# EAGLE board plugwatch (EAGLE 9.5.0)
REV: C
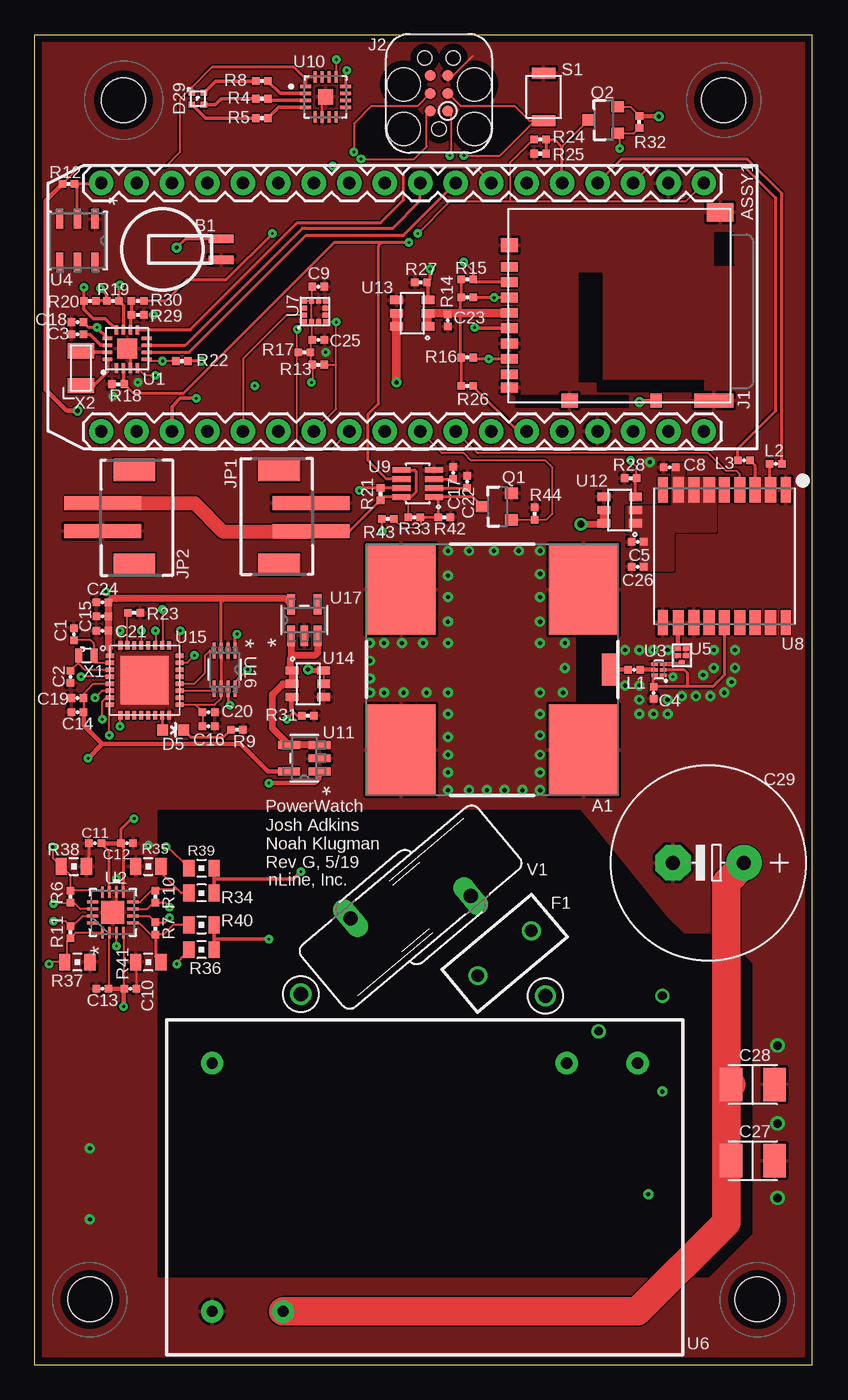
[diagram p6: board, top side]
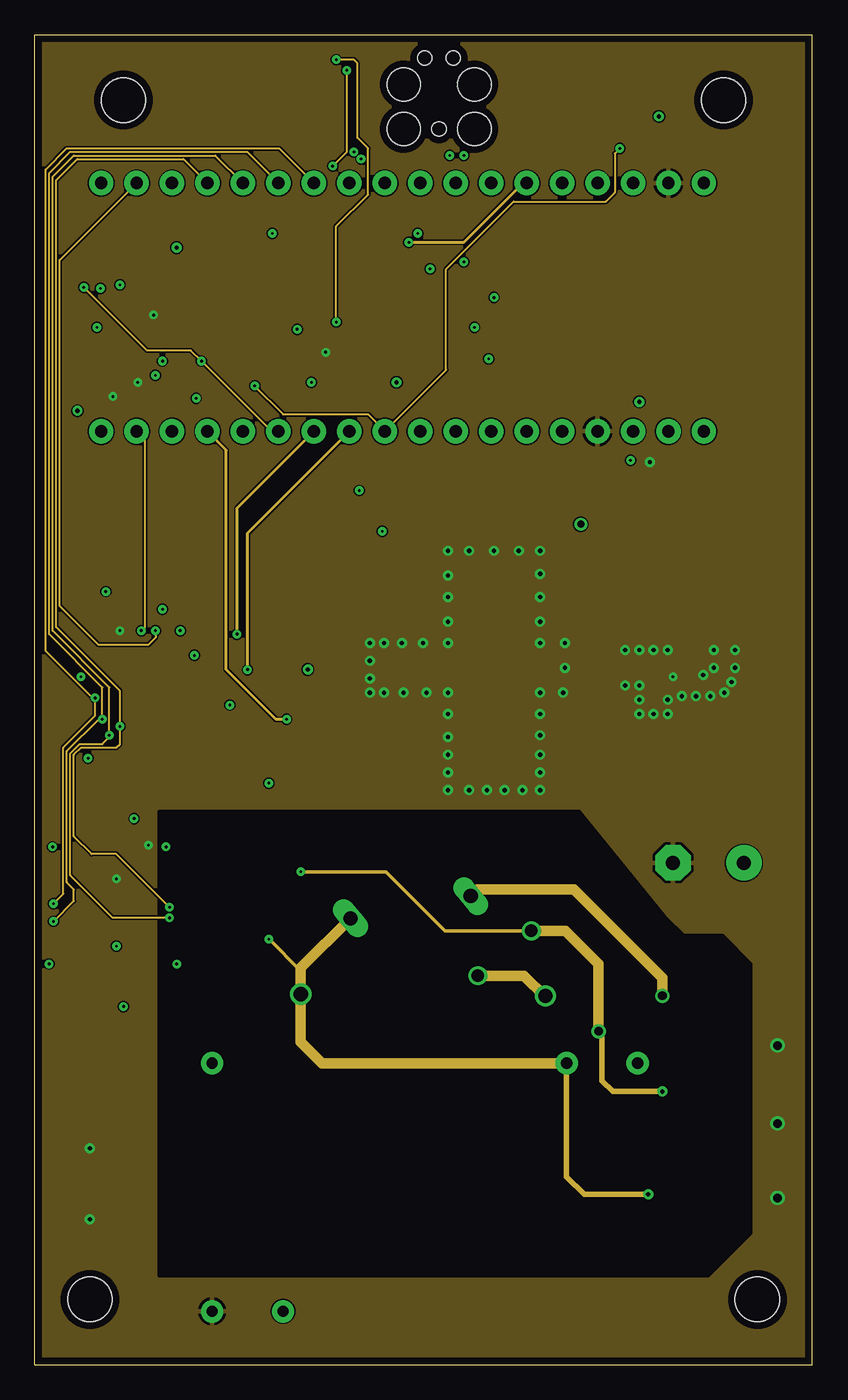
[diagram p7: board, inner layer Route2]
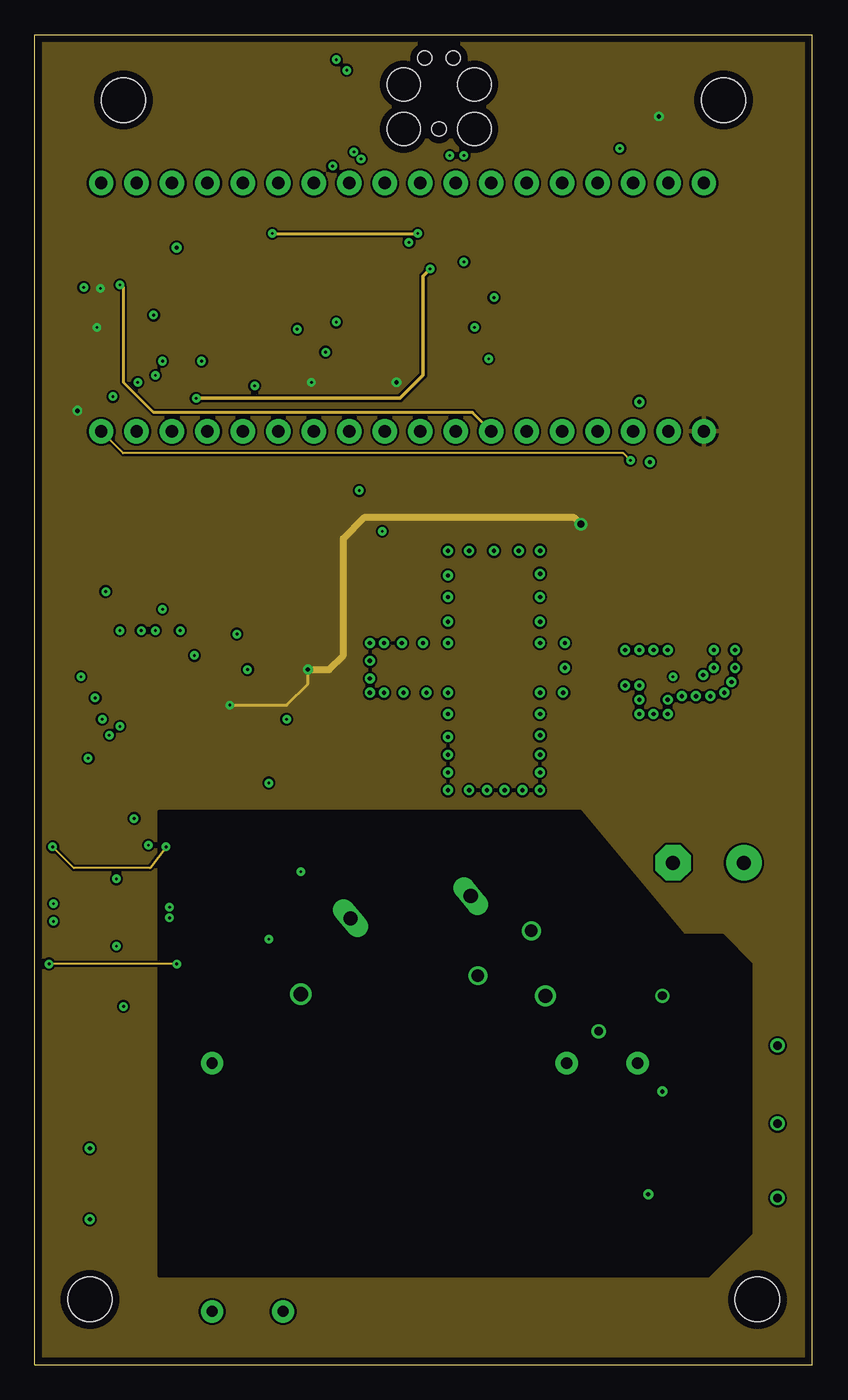
[diagram p8: board, inner layer Route15]
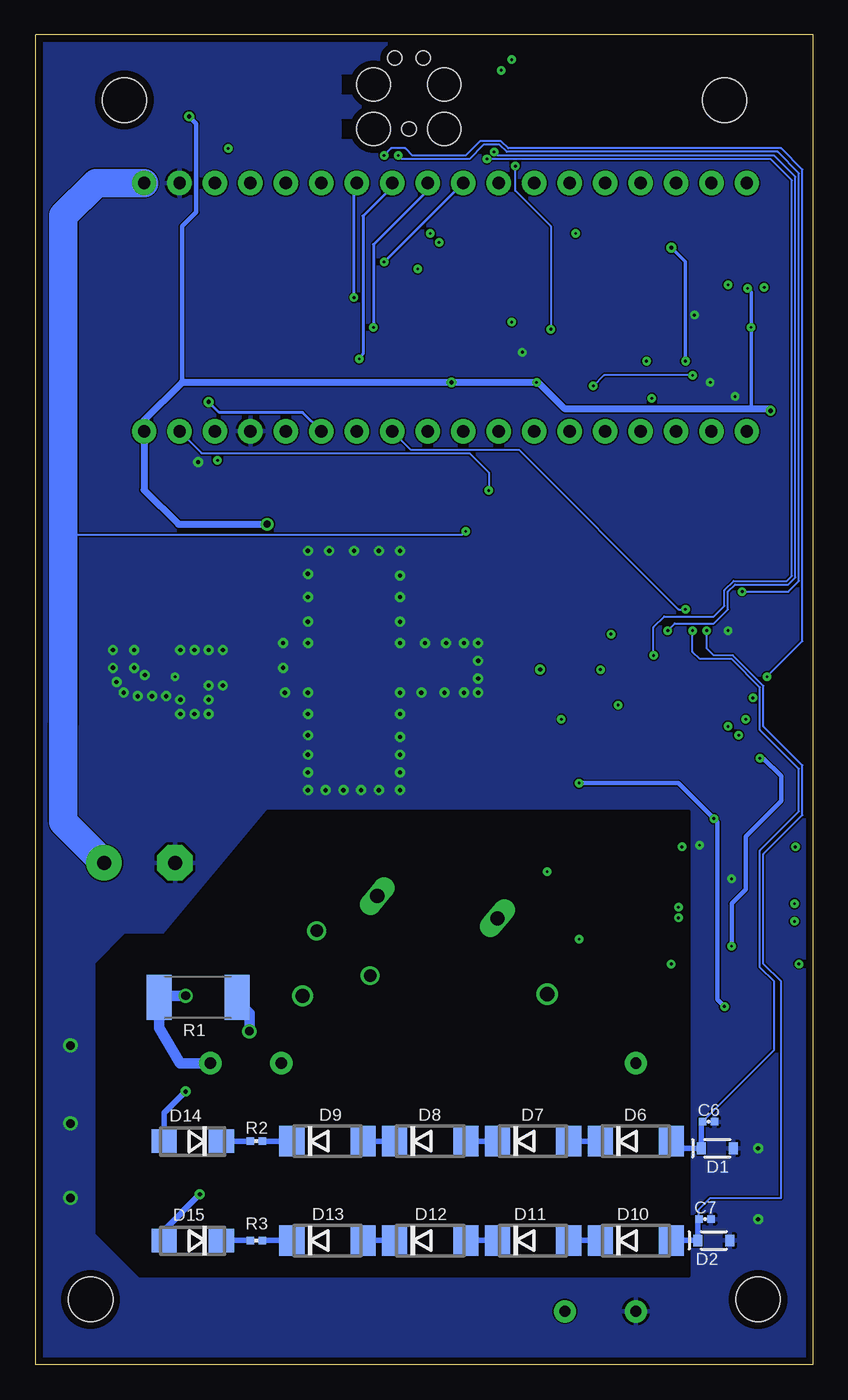
[diagram p9: board, bottom side, seen from below]

Size 55.7 x 95.25 mm. Coordinates in mm from the lower left corner, seen from the top.
Outline: 0,0 0,95.25 55.7,95.25 55.7,0 0,0
Copper layers (1+2*15+16): Top 0.0178mm / dielectric 12mil / Route2 0.0356mm / dielectric 28mil / Route15 0.0356mm / dielectric 12mil / Bottom 0.0178mm
Design rules "sunstone-4lyr_v1.0.0.3 *": minimum track width 4mil, minimum drill 8mil, track to track 4mil, track to pad 4mil, pad to pad 4mil, via to via 4mil, smd to smd 4mil, copper to edge 20mil, drill to drill 16mil, minimum pad ring 8mil, minimum via ring 8mil, stop-mask expansion 3mil, vias tented up to drill 50mil, thermal gap 8mil
Holes 3.17 mm at 3.94,4.67 6.35,90.58 51.77,4.67 49.35,90.58

## Footprints (pad centres in the part's own frame; a part is rotated, then mirrored left to right if it is on the bottom)
ANT1818B00BT1516S = smd 2.3 x 1.2: 0 0,-8.45 | smd 6.5 x 5: 1 -5.75,-6.55; 2 5.75,-6.55; 3 5.75,6.55; 4 -5.75,6.55
ELECTRON_SINGLE-ROW = drill 0.889 pad 1.753: 3V3 3.81,19.05; A0 31.75,1.27; A1 29.21,1.27; A2 26.67,1.27; A3 24.13,1.27; A4 21.59,1.27; A5 19.05,1.27; B0 46.99,1.27; B1 44.45,1.27; B2 41.91,1.27; B3 39.37,1.27; B4 36.83,1.27; B5 34.29,1.27; C0 46.99,19.05; C1 44.45,19.05; C2 41.91,19.05; C3 39.37,19.05; C4 36.83,19.05; C5 34.29,19.05; D0 31.75,19.05; D1 29.21,19.05; D2 26.67,19.05; D3 24.13,19.05; D4 21.59,19.05; D5 19.05,19.05; D6 16.51,19.05; D7 13.97,19.05; DAC 16.51,1.27; GND 11.43,19.05; GND@2 6.35,1.27; RST 6.35,19.05; RX 11.43,1.27; TX 8.89,1.27; VBAT 8.89,19.05; VIN 3.81,1.27; WKP 13.97,1.27
MS518SE-FL35E = smd 1.8 x 0.6: + 4.2,0.75; - 4.2,-0.75
0402_CAP = smd 0.536 x 0.546: 1 -0.433,0; 2 0.433,0
1210_CAP = smd 2.4 x 1.6: 1 0,1.55; 2 0,-1.55
E5-13 = drill 1.016 pad 2.54: + -2.54,0 | drill 1.016 pad 2.54 octagon: - 2.54,0
SOD-323 = smd 0.63 x 0.83: A 1.15,0; C -1.15,0
LED-0603 = smd 0.8 x 0.8: A 0,-0.75; C 0,0.75
DO214AA = smd 1.8 x 2.2: A 2.55,0; C -2.55,0
DO214AC = smd 1.8 x 1.7: A 2.05,0; C -2.05,0
1MM_SQ_4PAD = smd 0.457 x 0.457: 1 0.432,0.432; 2 0.432,-0.432; 3 -0.432,-0.432; 4 -0.432,0.432
MIRCRO_FUSE_5MM = drill 0.9: P$1 -2.5,0; P$2 2.5,0
DM3AT-SF-PEJM5 = smd 0.7 x 1.2: 1 3.2,-0.1; 2 2.1,-0.1; 3 1,-0.1; 4 -0.1,-0.1; 5 -1.2,-0.1; 6 -2.3,-0.1; 7 -3.4,-0.1; 8 -4.5,-0.1; B -5.45,-0.1 | smd 1 x 0.8: A -6.4,-10.6 | smd 1 x 1.2: MOUNT0 4.75,-0.1; MOUNT1 -6.4,-4.4 | smd 1 x 2.8: MOUNT2 -6.4,-14.75 | smd 1.3 x 1.9: MOUNT3 7.1,-15.2
TC2030-IDC = smd 0.787 x 0.787: 1 -1.27,-0.635; 2 -1.27,0.635; 3 0,-0.635; 4 0,0.635; 5 1.27,-0.635; 6 1.27,0.635 | hole 2.375: -2.54,2.54; 0.635,2.54; 0.635,-2.54; -2.54,-2.54 | hole 1.016: -2.54,0; 2.54,1.016; 2.54,-1.016
JST-2-SMD-VERT = smd 1 x 5.5: GND 1,-2; VCC -1,-2 | smd 1.6 x 3: P$1 -3.4,0.27; P$2 3.4,0.27
SOT23-3 = smd 0.8 x 0.9: 1 -0.95,-1; 2 0.95,-1; 3 0,1.1
R2512 = smd 1.8 x 3.2: 1 -2.8,0; 2 2.8,0
0402_RES = smd 0.536 x 0.546: 1 -0.433,0; 2 0.433,0
0805_RES = smd 0.8 x 1.2: 1 -0.9,0; 2 0.9,0
B3U-1000P = smd 0.8 x 1.7: 1 -1.7,0; 2 1.7,0
TESTPOINT_0.040IN = drill 1.016: TESTPOINT 0,0
QFN-16-3MM = smd 0.7 x 0.25: 1 -1.4,0.75; 2 -1.4,0.25; 3 -1.4,-0.25; 4 -1.4,-0.75; 9 1.35,-0.75; 10 1.35,-0.25; 11 1.35,0.25; 12 1.35,0.75 | smd 0.25 x 0.7: 5 -0.75,-1.4; 6 -0.25,-1.4; 7 0.25,-1.4; 8 0.75,-1.4; 13 0.75,1.4; 14 0.25,1.4; 15 -0.25,1.4; 16 -0.75,1.4 | smd 1.45 x 1.45: GND 0,0
CP_16_27 = smd 0.813 x 0.203: 1 -1.448,0.75; 2 -1.448,0.25; 3 -1.448,-0.25; 4 -1.448,-0.75; 9 1.448,-0.75; 10 1.448,-0.25; 11 1.448,0.25; 12 1.448,0.75 | smd 0.203 x 0.813: 5 -0.75,-1.448; 6 -0.25,-1.448; 7 0.25,-1.448; 8 0.75,-1.448; 13 0.75,1.448; 14 0.25,1.448; 15 -0.25,1.448; 16 -0.75,1.448 | smd 1.651 x 1.651: 17 0,0
LNA-TSLP-6-2-ALT = smd 0.45 x 0.25: 1 -0.3,0.4; 2 -0.3,0; 3 -0.3,-0.4; 4 0.3,-0.4; 5 0.3,0; 6 0.3,0.4
21-0382 = smd 1.346 x 0.533: 1 -1.525,1.27; 2 -1.525,0; 3 -1.525,-1.27; 4 1.525,-1.27; 5 1.525,0; 6 1.525,1.27
QCS5I = smd 0.35 x 0.425: 1 -0.5,0; 2 0,-0.287; 3 0.5,-0.287; 4 0.5,0.287; 5 0,0.287
IRM-03 = drill 0.8 pad 1.6: AC/L 15.24,8.89; AC/N 10.16,8.89; NC -15.24,8.89; V+ -10.16,-8.89; V- -15.24,-8.89
LGA-12 = smd 0.375 x 0.35: 1 -0.75,0.75; 2 -0.75,0.25; 3 -0.75,-0.25; 4 -0.75,-0.75; 7 0.75,-0.75; 8 0.75,-0.25; 9 0.75,0.25; 10 0.75,0.75 | smd 0.35 x 0.375: 5 -0.25,-0.75; 6 0.25,-0.75; 11 0.25,0.75; 12 -0.25,0.75
MAX-M8 = smd 1.8 x 0.7: 1 4.75,-4.4; 9 4.75,4.4; 10 -4.75,4.4; 18 -4.75,-4.4 | smd 1.8 x 0.8: 2 4.75,-3.3; 3 4.75,-2.2; 4 4.75,-1.1; 5 4.75,0; 6 4.75,1.1; 7 4.75,2.2; 8 4.75,3.3; 11 -4.75,3.3; 12 -4.75,2.2; 13 -4.75,1.1; 14 -4.75,0; 15 -4.75,-1.1; 16 -4.75,-2.2; 17 -4.75,-3.3
SOT-23-8 = smd 0.42 x 1.3: 1 -0.975,-1.17; 2 -0.325,-1.17; 3 0.325,-1.17; 4 0.975,-1.17; 5 0.975,1.17; 6 0.325,1.17; 7 -0.325,1.17; 8 -0.975,1.17
QFN50P300X300X80-17N = smd 0.84 x 0.27: 1 -1.435,0.75; 2 -1.435,0.25; 3 -1.435,-0.25; 4 -1.435,-0.75; 9 1.435,-0.75; 10 1.435,-0.25; 11 1.435,0.25; 12 1.435,0.75 | smd 0.27 x 0.84: 5 -0.75,-1.435; 6 -0.25,-1.435; 7 0.25,-1.435; 8 0.75,-1.435; 13 0.75,1.435; 14 0.25,1.435; 15 -0.25,1.435; 16 -0.75,1.435 | smd 1.1 x 1.1: 17 0,0
DDC5 = smd 1.575 x 0.559: 1 -1.092,0.95; 2 -1.092,0; 3 -1.092,-0.95; 4 1.092,-0.95; 5 1.092,0.95
TSOT23-6 = smd 0.6 x 0.927: 1 -0.95,-1.126; 2 0,-1.126; 3 0.95,-1.126; 4 0.95,1.126; 5 0,1.126; 6 -0.95,1.126
UQFN-32 = smd 0.6 x 0.3: 1 -2.5,1.75; 2 -2.5,1.25; 3 -2.5,0.75; 4 -2.5,0.25; 5 -2.5,-0.25; 6 -2.5,-0.75; 7 -2.5,-1.25; 8 -2.5,-1.75; 17 2.5,-1.75; 18 2.5,-1.25; 19 2.5,-0.75; 20 2.5,-0.25; 21 2.5,0.25; 22 2.5,0.75; 23 2.5,1.25; 24 2.5,1.75 | smd 0.3 x 0.6: 9 -1.75,-2.5; 10 -1.25,-2.5; 11 -0.75,-2.5; 12 -0.25,-2.5; 13 0.25,-2.5; 14 0.75,-2.5; 15 1.25,-2.5; 16 1.75,-2.5; 25 1.75,2.5; 26 1.25,2.5; 27 0.75,2.5; 28 0.25,2.5; 29 -0.25,2.5; 30 -0.75,2.5; 31 -1.25,2.5; 32 -1.75,2.5 | smd 3.45 x 3.45: THERMAL 0,0
DCU8 = smd 1.168 x 0.203: 1 -1.372,0.75; 2 -1.372,0.25; 3 -1.372,-0.25; 4 -1.372,-0.75; 5 1.372,-0.75; 6 1.372,-0.25; 7 1.372,0.25; 8 1.372,0.75
DBV5 = smd 1.473 x 0.559: 1 -1.118,0.95; 2 -1.118,0; 3 -1.118,-0.95; 4 1.118,-0.95; 5 1.118,0.95
S14K385 = drill 1.016 long: 1 -2.159,-3.81; 2 2.159,3.81
ABS05 = smd 0.5 x 1: A -0.55,0; B 0.55,0
2-SMD = smd 1.092 x 1.905: 1 -1.245,0; 2 1.245,0

## Placement (x,y rotation side)
A1  GPS-ANTENNA  [ANT1818B00BT1516S]  32.77,49.78 90 top
ASSY1  ELECTRON  [ELECTRON_SINGLE-ROW]  51.74,85.9 180 top
B1  [MS518SE-FL35E]  9.14,79.88 0 top
C1  4.3pF  [0402_CAP]  2.79,52.32 270 top
C2  4.3pF  [0402_CAP]  2.54,49.28 90 top
C3  47pF  [0402_CAP]  3.05,73.79 180 top
C4  10nF  [0402_CAP]  44.32,48.13 90 top
C5  10nF  [0402_CAP]  43.18,58.93 0 top
C6  10nF  [0402_CAP]  7.49,17.4 0 bottom
C7  10nF  [0402_CAP]  7.75,10.41 0 bottom
C8  0.1uF  [0402_CAP]  45.47,64.26 0 top
C9  0.1uF  [0402_CAP]  20.32,77.22 0 top
C10  0.1uF  [0402_CAP]  6.86,26.92 0 top
C11  0.1uF  [0402_CAP]  4.32,37.34 180 top
C12  0.1uF  [0402_CAP]  6.6,37.34 0 top
C13  0.1uF  [0402_CAP]  4.83,26.92 180 top
C14  0.1uF  [0402_CAP]  3.05,46.74 180 top
C15  0.1uF  [0402_CAP]  4.83,53.59 180 top
C16  0.1uF  [0402_CAP]  12.45,45.72 0 top
C17  0.82uF  [0402_CAP]  29.97,63.88 90 top
C18  1uF  [0402_CAP]  3.05,74.68 180 top
C19  1uF  [0402_CAP]  3.05,47.75 180 top
C20  1uF  [0402_CAP]  12.45,46.74 0 top
C21  1uF  [0402_CAP]  4.83,52.58 180 top
C22  2.2uF  [0402_CAP]  30.99,63.25 90 top
C23  4.7uF  [0402_CAP]  29.59,74.8 270 top
C24  4.7uF  [0402_CAP]  4.83,54.61 180 top
C25  10uF  [0402_CAP]  20.32,73.41 0 top
C26  10uF  [0402_CAP]  43.18,57.15 0 top
C27  100uF  [1210_CAP]  51.44,14.61 90 top
C28  100uF  [1210_CAP]  51.44,20.07 90 top
C29  2000uF  [E5-13]  48.26,35.94 180 top
D1  3V  [SOD-323]  6.86,15.49 0 bottom
D2  3V  [SOD-323]  7.11,8.89 0 bottom
D5  LED0603  [LED-0603]  9.91,45.47 270 top
D6  200V  [DO214AA]  12.7,16 0 bottom
D7  200V  [DO214AA]  20.07,16 0 bottom
D8  200V  [DO214AA]  27.43,16 0 bottom
D9  200V  [DO214AA]  34.8,16 0 bottom
D10  200V  [DO214AA]  12.7,8.89 0 bottom
D11  200V  [DO214AA]  20.07,8.89 0 bottom
D12  200V  [DO214AA]  27.43,8.89 0 bottom
D13  200V  [DO214AA]  34.8,8.89 0 bottom
D14  1000Vr  [DO214AC]  44.45,16 180 bottom
D15  1000Vr  [DO214AC]  44.45,8.89 180 bottom
D29  [1MM_SQ_4PAD]  11.68,90.68 90 top
F1  300VAC - 500ma  [MIRCRO_FUSE_5MM]  33.66,29.46 40 top
J1  DM3AT-SF-PEJM5  [DM3AT-SF-PEJM5]  33.91,75.44 90 top
J2  TC2030-JLINK-L  [TC2030-IDC]  28.96,91.06 90 top
JP1  [JST-2-SMD-VERT]  17.78,60.71 90 top
JP2  [JST-2-SMD-VERT]  6.86,60.71 270 top
L1  5.6n  [0402_CAP]  42.93,49.78 180 top
L2  1k  [0402_CAP]  53.09,64.52 0 top
L3  1k  [0402_CAP]  50.8,64.77 180 top
Q1  MOSFET-NCHANNELSMD  [SOT23-3]  33.15,61.47 90 top
Q2  NX3008PBK  [SOT23-3]  40.77,89.15 90 top
R1  1  [R2512]  44.06,26.3 180 bottom
R2  10  [0402_RES]  39.88,16 180 bottom
R3  10  [0402_RES]  39.88,8.89 180 bottom
R4  475  [0402_RES]  16.26,90.68 0 top
R5  750  [0402_RES]  16.26,89.28 0 top
R6  1.00k  [0402_RES]  2.54,33.53 270 top
R7  1.00k  [0402_RES]  8.64,31.24 90 top
R8  1.69k  [0402_RES]  16.26,91.95 0 top
R9  1.69k  [0402_RES]  14.48,45.47 180 top
R10  3.74k  [0402_RES]  8.64,33.53 270 top
R11  3.74k  [0402_RES]  2.54,30.99 270 top
R12  5.1k  [0402_RES]  2.41,84.58 0 top
R13  10k  [0402_RES]  20.32,71.63 180 top
R14  10k  [0402_RES]  30.99,76.45 180 top
R15  10k  [0402_RES]  30.99,77.72 180 top
R16  10k  [0402_RES]  30.99,72.14 180 top
R17  10k  [0402_RES]  19.3,72.52 0 top
R18  10k  [0402_RES]  5.97,70.23 180 top
R19  10k  [0402_RES]  5.59,76.2 0 top
R20  10k  [0402_RES]  3.94,76.2 180 top
R21  10k  [0402_RES]  24.77,62.36 90 top
R22  10k  [0402_RES]  10.54,71.88 0 top
R23  10k  [0402_RES]  7.11,53.85 180 top
R24  34k  [0402_RES]  36.2,87.76 0 top
R25  66.5k  [0402_RES]  36.2,86.74 180 top
R26  100k  [0402_RES]  30.99,70.1 180 top
R27  100k  [0402_RES]  27.66,77.52 0 top
R28  100k  [0402_RES]  42.67,63.5 0 top
R29  100k  [0402_RES]  7.37,76.2 180 top
R30  100k  [0402_RES]  7.37,75.18 0 top
R31  100k  [0402_RES]  19.56,46.48 180 top
R32  100k  [0402_RES]  43.31,89.03 270 top
R33  825k  [0402_RES]  27.18,60.71 0 top
R34  953k  [0805_RES]  11.94,33.78 180 top
R35  953k  [0805_RES]  8.13,35.69 0 top
R36  953k  [0805_RES]  11.94,29.72 180 top
R37  953k  [0805_RES]  3.05,28.83 180 top
R38  953k  [0805_RES]  2.79,35.69 0 top
R39  953k  [0805_RES]  11.94,35.56 0 top
R40  953k  [0805_RES]  11.94,31.5 0 top
R41  953k  [0805_RES]  8.13,28.83 180 top
R42  1M  [0402_RES]  29.34,60.71 0 top
R43  1M  [0402_RES]  25.27,60.58 0 top
R44  1M  [0402_RES]  35.81,60.96 90 top
S1  B3U-1000P  [B3U-1000P]  36.45,90.81 270 top
TP1  TEST_POINT_0.040IN  [TESTPOINT_0.040IN]  36.58,26.42 0 top
TP2  TEST_POINT_0.040IN  [TESTPOINT_0.040IN]  19.05,26.54 0 top
U1  AB1815-T3  [QFN-16-3MM]  6.6,72.77 90 top
U2  ADA4096-4ACPZ-R7  [CP_16_27]  5.59,32.38 90 top
U3  BGA725L6-ALT  [LNA-TSLP-6-2-ALT]  44.7,49.78 180 top
U4  DS2401P+  [21-0382]  3.05,80.52 270 top
U5  SAFFB1G56KB0F0A  [QCS5I]  46.35,50.8 90 top
U6  IRM-03-5V  [IRM-03]  27.94,12.7 0 top
U7  LIS2DH12  [LGA-12]  20.07,75.44 90 top
U8  MAX-M8  [MAX-M8]  49.4,57.91 90 top
U9  MAX67XXMAX6749MAX67XX  [SOT-23-8]  27.43,63.12 90 top
U10  MAX7315ATET  [QFN50P300X300X80-17N]  20.83,90.81 0 top
U11  REF2030AIDDCR  [DDC5]  19.3,43.43 180 top
U12  SIP32510  [TSOT23-6]  41.91,61.21 90 top
U13  SIP32510  [TSOT23-6]  27.05,75.31 90 top
U14  SIP32510  [TSOT23-6]  19.56,48.77 270 top
U15  STM32L432KC  [UQFN-32]  7.87,49.02 0 top
U16  TCA9406DCUR  [DCU8]  13.59,49.78 270 top
U17  TPS79330DBVR  [DBV5]  19.3,53.34 90 top
V1  S14K385  [S14K385]  26.92,32.77 130 top
X1  ABS05-32.768KHZ-T  [ABS05]  3.68,50.8 0 top
X2  ABS07-32.768KHZ-7-T  [2-SMD]  3.3,71.37 90 top

## Tracks (layer width: path | path; a pad name or v marks a point on that pad's centre or on a via)
5V  (via drill 0.2)
  Top 0.152: R43.1 24.84,59.74 v24.89,59.69 | ASSY1.VIN 46.61,83.31 34.04,83.31 | v27.43,81.03 29.72,83.31 34.04,83.31 | R24.1 35.69,87.76 34.04,86.11 34.04,83.31 | C27.1 49.53,14.25 49.53,14.22
  Top 0.203: R29.1 9.4,76.2 10.92,77.72 13.72,77.72 v17.02,81.03
  Top 2.032: U6.V+ 43.18,3.81 49.53,10.16 49.53,14.22 49.53,20.07 | C29.+ 50.8,35.81 49.53,34.54 49.53,20.07 | C28.1 49.53,20.07
  Route15 0.203: v17.02,81.03 v27.43,81.03
  Bottom 0.152: v24.89,59.69 25.15,59.44 53.72,59.44 | 53.72,59.44
  Bottom 2.032: ASSY1.VIN 51.38,84.63 53.72,82.3 53.72,59.44 53.73,45.97 53.73,38.87 C29.+
!EXTERNAL_RST  (via drill 0.2)
  Top 0.203: U9.7 R21.2 23.42,62.79 v23.24,62.61
  Bottom 0.152: ASSY1.RST 43.81,65.28 24.64,65.28 23.24,63.88 v23.24,62.61
!RST  (via drill 0.2)
  Top 0.152: J2.3 30.48,90.17 34.37,90.17 35.43,89.11 35.81,89.11 | 35.81,89.11 S1.2 | U15.4 v3.31,49.27 v3.3,49.28 | v30.73,86.61 33.32,86.61 35.81,89.11
  Bottom 0.152: v3.3,49.28 0.76,51.82 0.76,85.6 2.29,87.12 21.84,87.12 22.35,87.63 23.88,87.63 24.89,86.61 28.7,86.61 29.21,87.12 30.23,87.12 v30.73,86.61
!RTC_CS  (via drill 0.2)
  Top 0.203: v3.5,77.17 R20.2 | v11.94,71.88 R22.2
  Top 0.254: R20.2 3.5,75.62 4.19,74.93 5.04,74.93 U1.12
  Route2 0.152: ASSY1.C5 16.97,66.85 v11.94,71.88 11.18,72.64 8.03,72.64 v3.5,77.17
!RTC_INT1  (via drill 0.2)
  Top 0.203: v6.1,77.34 6.02,77.27 R19.2
  Top 0.254: U1.11 6.35,75.87 R19.2
  Route15 0.152: ASSY1.D5 32.26,67.28 32.26,67.31
  Route15 0.203: 32.26,67.31 31.37,68.2 8.51,68.2 6.35,70.36 6.35,77.22 6.22,77.34 v6.1,77.34
!RTC_INT2  (via drill 0.2)
  Top 0.152: Q2.1 41.91,88.2 | 41.91,88.2 42.92,88.2 R32.2 | v41.91,87.12 41.91,88.2 | U1.4 7.86,70.87 v8.64,70.87
  Route2 0.152: ASSY1.D2 25.08,66.86 | 25.08,66.86 29.46,71.25 29.46,78.49 34.29,83.31 40.89,83.31 41.54,83.96 41.54,86.75 v41.91,87.12 | v15.75,70.1 17.78,68.07 23.88,68.07 25.08,66.86
  Bottom 0.152: v8.64,70.87 14.99,70.87 v15.75,70.1
!SD_CS  (via drill 0.2)
  Top 0.203: J1.2 31.61,77.54 R15.1 31.42,78.31 v30.73,78.99
  Bottom 0.203: ASSY1.A2 30.71,78.99 v30.73,78.99
!SD_DETECT  (via drill 0.3)
  Top 0.152: R26.1 | R26.1 31.38,70.06
  Top 0.203: ASSY1.D6 34.59,66.85 31.38,70.06 | J1.A 43.38,69.04 v43.31,68.96
  Bottom 0.203: ASSY1.D6 36.58,68.2 42.55,68.2 v43.31,68.96
AC_COPROC_VCC  (via drill 0.2)
  Top 0.152: C16.1 C20.1 11.48,47.27 U15.17 12.89,47.27 13.34,47.72 U16.6 | 5.84,54.86 5.59,54.86 v5.08,55.37 | J2.1 29.84,89.53 29.84,86.74 v29.72,86.61
  Top 0.203: 13.46,54.86 13.34,54.74 U16.3 U16.6 | C15.1 C21.1
  Top 0.305: 5.33,51.31 5.37,51.27 U15.1
  Top 0.508: U17.5 17.95,54.86 13.46,54.86 5.84,54.86 5.51,54.86 C24.1 C21.1 5.26,51.38 5.33,51.31
  Bottom 0.152: v5.08,55.37 1.78,55.37 1.02,56.13 1.02,85.34 2.54,86.87 21.95,86.87 22.46,87.38 23.62,87.38 24.64,86.36 29.46,86.36 v29.72,86.61
AC_L_800V_DETECT  (via drill 0.2)
  Top 0.152: v8.64,52.58 8.64,51.53 U15.27
  Route2 0.152: v8.64,52.58 8.64,52.07 8.13,51.56 4.57,51.56 1.78,54.36 1.78,79.12 ASSY1.B1
  Bottom 0.152: C6.1 2.79,22.53 2.79,27.43 3.81,28.45 3.81,36.83 1.02,39.62 1.02,42.67 3.81,45.47 3.81,48.51 5.84,50.55 8.13,50.55 8.64,51.05 v8.64,52.58
  Bottom 0.406: D6.A 9.63,15.49 D1.C 8.01,17.32 C6.1
AC_L_HV_OUT  (via drill 0.2)
  Top 0.152: U2.14 3.25,32.63 2.79,33.09 R6.2 2.46,33.02 v1.33,33.02 | v4.32,47.75 4.84,48.27 U15.6
  Route2 0.152: v1.33,33.02 2.03,33.72 2.03,44.2 4.32,46.48 v4.32,47.75 4.29,47.78 4.12,47.78 0.76,51.13 0.76,85.6 2.29,87.12 17.5,87.12 ASSY1.A0
AC_L_LV_OUT  (via drill 0.2)
  Top 0.152: U2.7 8.05,32.63 8.51,33.09 R10.2 9.32,33.09 v9.65,32.77 | v6.1,45.72 6.1,46.49 U15.9
  Route2 0.152: v9.65,32.77 5.84,36.58 4.06,36.58 2.79,37.85 2.79,43.69 3.3,44.2 5.84,44.2 6.1,44.45 v6.1,45.72 6.1,48.26 1.52,52.83 1.52,84.84 3.05,86.36 10.64,86.36 ASSY1.B3
AC_L_SENSE  (via drill 0.2, 0.3, 0.61)
  Top 0.254: v19.05,35.31 18.52,34.78 12.84,34.78 R34.1 R39.2
  Route2 0.254: v19.05,35.31 25.15,35.31 29.38,31.07 F1.P$2
  Route2 0.406: v40.39,23.88 40.64,23.62 40.64,20.32 41.4,19.56 v44.96,19.56
  Route2 0.762: F1.P$2 38.02,31.07 40.39,28.7 v40.39,23.88
  Bottom 0.406: v44.96,19.56 46.5,18.02 D14.A
  Bottom 0.762: v40.39,23.88 40.39,25.17 41.26,26.05 R1.1
AC_N  (via drill 0.2, 0.3)
  Top 0.254: R40.2 12.84,30.48 | 12.84,30.48 R36.1 | v16.76,30.48 12.84,30.48
  Route2 0.152: 19.05,28.19 19.05,27.94
  Route2 0.254: v16.76,30.48 19.05,28.19
  Route2 0.406: U6.AC/N 38.1,13.46 39.37,12.19 v43.94,12.19
  Route2 0.762: V1.2 19.05,28.4 19.05,27.94 TP2.TESTPOINT 19.05,23.11 20.57,21.59 U6.AC/N
  Bottom 0.406: v43.94,12.19 46.5,9.63 D15.A
AC_N_800V_DETECT  (via drill 0.2)
  Top 0.152: v7.62,52.58 v7.62,52.57 U15.29
  Route2 0.152: v7.62,52.58 7.87,52.83 7.87,66.27 ASSY1.C1
  Bottom 0.152: C7.1 8.18,11.12 7.37,11.94 2.29,11.94 2.29,27.43 3.56,28.7 3.56,36.58 0.76,39.37 0.76,42.93 3.56,45.72 3.56,48.62 5.74,50.8 7.11,50.8 7.62,51.31 v7.62,52.58
  Bottom 0.406: D10.A D2.C 8.26,10.33 C7.1
AC_N_HV_OUT  (via drill 0.2)
  Top 0.152: U2.6 8.18,32.13 R7.2 9.32,31.68 v9.65,32 | v5.33,45.09 5.33,47.23 U15.8
  Route2 0.152: v9.65,32 5.59,32 2.54,35.05 2.54,43.79 3.2,44.45 4.83,44.45 5.33,44.96 v5.33,45.09 5.33,48.51 1.27,52.58 1.27,85.09 2.79,86.61 12.93,86.61 ASSY1.B4
AC_N_LV_OUT  (via drill 0.2)
  Top 0.152: U2.15 3.43,32.13 2.72,31.42 R11.1 2.21,31.75 v1.33,31.75 | v4.83,46.23 4.83,47.5 5.1,47.77 U15.7
  Route2 0.152: v1.33,31.75 2.79,33.21 2.79,34.04 2.29,34.54 2.29,43.94 4.57,46.23 v4.83,46.23 4.83,48.51 1.02,52.32 1.02,85.34 2.54,86.87 15.21,86.87 ASSY1.B5
AC_SCL
  Top 0.152: U15.19 12.7,48.27 U16.5
AC_SDA
  Top 0.152: U15.20 11.43,48.77 12.19,49.53 12.19,50.8 12.55,51.16 U16.4
AC_SENSE_PWR_EN  (via drill 0.2)
  Top 0.203: R31.2 18.8,46.48 18.29,46.99 18.29,47.75 18.32,47.93 U14.3 18.43,46.63 v18.03,46.23
  Route2 0.203: v18.03,46.23 17.27,46.23 13.72,49.78 13.72,65.51 ASSY1.C3
AC_SENSE_VCC
  Top 0.508: U17.3 20.25,50.99 20.07,50.8 18.54,50.8 18.35,50.61 | U17.1 18.35,50.61 | 18.35,50.61 18.29,50.55 18.29,49.86 U14.1 U14.2 17.78,48.77 17.02,48.01 17.02,45.58 U11.4 U11.3
ACCEL_INT
  Top 0.152: U7.12 18.04,75.19 14.91,72.06 ASSY1.C4
ANT
  Top 0.318: A1.0 L1.2
BOOT0
  Top 0.152: U15.31 6.6,51.54 6.6,53.85 R23.2
GND  (via drill 0.2, 0.3, 0.61)
  Top 0.152: J2.5 29.97,92.33 31.37,93.73 | U10.6 20.58,90.56 U10.17 | U2.10 5.84,32.63 U2.17 | C10.2 7.29,28.43 R41.2
  Top 0.203: U1.3 6.85,72.52 U1.GND | R38.2 3.88,35.88 C11.2
  other vias: 5.59,69.34 7.37,70.36 29.59,44.96 29.59,46.61 29.59,48.13 28.07,48.13 26.42,48.13 26.29,51.69 27.81,51.69 29.59,51.69 29.59,53.21 29.59,54.99 29.59,56.52 29.59,58.29 36.2,45.09 36.2,46.61 36.2,48.13 37.85,48.13 37.97,49.91 37.97,51.69 36.2,51.69 36.2,53.21 36.2,54.99 36.2,56.64 36.2,58.29 8.51,75.18 25.02,51.69 24,51.69 24,50.42 24,49.15 24,48.13 25.02,48.13 29.59,43.69 29.59,42.42 29.59,41.15 31.11,41.15 32.38,41.15 33.66,41.15 34.92,41.15 36.2,41.15 36.2,42.42 36.2,43.69 31.11,58.29 32.89,58.29 34.67,58.29 42.29,51.18 43.31,51.18 44.32,51.18 45.34,51.18 42.29,48.64 43.31,48.64 43.31,47.62 43.31,46.61 44.32,46.61 45.34,46.61 45.34,47.62 46.35,47.88 47.37,47.88 48.39,47.88 49.4,48.13 49.91,48.9 50.16,49.91 50.16,51.18 48.64,51.18 48.64,49.91 47.88,49.4 45.72,49.28 53.21,22.86 53.21,17.27 53.21,11.94 8.13,37.21 5.84,34.8 20.83,72.52 44.07,64.64 3.94,10.41 3.94,15.49 6.1,52.58
  pour Bottom (rank 2): 55.75,0 0,0 0,95.25 55.63,95.25
  pour Route2 (rank 2): 55.75,0 0,0 0.13,95.25 55.37,95.12
  pour Top (rank 2): 55.75,0 0,0 0,95.25 55.63,95.25
GPS_PPS  (via drill 0.2)
  Top 0.152: U8.4 50.5,63.8 50.29,64.01 49.53,64.01 48.26,65.28 31.73,65.28 ASSY1.D4 | v9.14,54.1 9.14,51.54 U15.26
  Bottom 0.152: ASSY1.D4 28.83,65.53 21.08,65.53 9.65,54.1 v9.14,54.1
GPS_PWR_EN  (via drill 0.2)
  Top 0.152: R28.2 43.1,64.34 v42.67,64.77
  Top 0.203: U12.3 43.04,63.43 R28.2
  Route15 0.152: ASSY1.C0 6.33,65.28 42.16,65.28 v42.67,64.77
GPS_RF_IN
  Top 0.318: U5.4 46.07,53.13 U8.11
GPS_RXD
  Top 0.203: L3.2 50.37,65.61 53.09,68.33 53.09,83.57 50.8,85.85 44.07,85.85 ASSY1.TX
GPS_TXD
  Top 0.203: L2.2 53.52,83.89 51.05,86.36 42.04,86.36 ASSY1.RX
GPS_VCC
  pour Top (isolate 0.152, no thermals): 42.42,59.69 42.42,61.47 45.72,61.47 45.72,64.52 46.48,64.52 46.48,63.5 48.77,63.5 48.77,59.69 45.72,59.69 45.72,56.9 43.43,56.9 43.43,59.69
LNA_IN
  Top 0.318: L1.1 U3.5
LNA_OUT
  Top 0.318: U3.3 46.24,50.18 U5.1
N$1
  Top 0.203: D5.C 11.16,44.96 13.54,44.96 R9.2
N$2  (via drill 0.61)
  Route2 0.762: V1.1 31.7,34.04 38.61,34.04 44.96,27.69 v44.96,26.42
  Bottom 0.762: U6.AC/L 45.36,21.59 46.86,24.1 R1.2 45.99,26.42 v44.96,26.42
N$3  (via drill 0.2)
  Top 0.152: U2.1 2.92,30.94 R11.2 2.29,30.3 2.29,28.86 R37.2 1.14,28.83 v1.02,28.7 | v10.16,28.7 11.01,29.71 R36.2
  Route15 0.152: v10.16,28.7 v1.02,28.7
N$4
  Top 0.152: U2.8 7.54,33.13 8.37,33.96 R10.1 8.71,34.04 10.23,34.04 | R34.2 10.49,33.78 10.23,34.04 | 10.23,34.04 8.86,35.41 R35.2
N$5  (via drill 0.2, 0.3)
  Top 0.152: R22.1 v9.14,71.88 8.14,71.88 U1.5
  Top 0.203: B1.+ 10.78,80.63 v10.16,80.01
  Bottom 0.254: v10.16,80.01 9.14,78.99 v9.14,71.88
N$6  (via drill 0.2)
  Top 0.152: U2.12 4.71,33.96 R6.1 2.54,35.06 2.52,35.06 R38.1 1.27,36.31 v1.27,37.08 | R39.1 9.51,37.08 v9.4,37.08
  Route15 0.152: v9.4,37.08 8.26,35.56 2.79,35.56 v1.27,37.08
N$7
  Top 0.203: U15.15 9.12,45.5 D5.A
N$8
  Top 0.152: U2.5 7.48,31.64 8.31,30.81 R7.1 9.22,30.81 9.91,31.5 R40.1
  Top 0.203: R7.1 8.64,29.22 R41.1
N$9
  Top 0.152: U15.3 3.57,49.77 3.13,50.21 3.13,50.3 | 3.13,50.3 X1.A | C2.2 3.13,50.3
N$10
  Top 0.152: ASSY1.WKP 37.77,87.26 Q2.3
  Top 0.203: ASSY1.WKP 37.77,87.22 37.29,87.7 37.15,87.76 R24.2 R25.1
N$11
  Top 0.152: U15.2 4.34,50.27 4.23,50.38 X1.B 4.23,51.65 3.99,51.89 C1.2
N$12
  Route2 0.762: TP1.TESTPOINT 36.58,26.32 35.04,27.86 F1.P$1
N$13
  Top 0.254: U1.14 4.7,73.02 4.48,73.24 4.48,73.26 3.96,73.79 C3.1
N$14
  Bottom 0.406: D9.A D8.C
N$15
  Bottom 0.406: D8.A D7.C
N$16
  Bottom 0.406: D7.A D6.C
N$18
  Top 0.203: R26.2 R16.2 30.48,72.21 30.48,75.31 30.48,76.38 R14.2 R15.2
  Top 0.508: U13.2 U13.1
  Top 0.61: U13.2 29.72,75.31 | 29.72,75.31 30.48,75.31 33.98,75.31 J1.4 | C23.1 29.64,75.24 29.72,75.31
N$20
  Top 0.254: U1.15 3.4,72.52 X2.2
N$21
  Top 0.254: U1.16 5.2,71.12 4.22,70.13 X2.1
N$23
  Top 0.152: U9.8 26.75,61.66 R33.1
  Top 0.203: U9.5 27.22,64.09 27.3,64.01 27.3,62.48 26.96,62.14 U9.8 24.98,62.14 R21.1 22.55,59.71 JP1.VCC
  Top 1.016: JP2.VCC 11.45,61.71 13.46,59.69 19.76,59.69 JP1.VCC
N$25
  Top 0.254: U1.10 6.85,75.11 R30.1 R29.2
N$26
  Top 0.254: D29.3 12.9,90.25 13.34,90.68 R4.1
N$30
  Bottom 0.406: R2.1 D9.C
N$31
  Top 0.152: R43.2 26.34,59.94 27.43,59.94 27.69,60.2 27.69,60.71
  Top 0.203: R33.2 27.69,60.71 R42.1 28.9,61.84 U9.1 31.37,62.14 Q1.3
N$32
  Bottom 0.406: D14.C R2.2
N$35
  Bottom 0.406: D13.A D12.C
N$36
  Top 0.203: U9.3 C17.1
N$37
  Bottom 0.406: D12.A D11.C
N$38
  Bottom 0.406: D11.A D10.C
N$39
  Top 0.203: U9.2 30.97,62.79 C22.1
N$40
  Top 0.203: L2.1 52.65,62.71 U8.2
N$41
  Top 0.203: U8.3 51.6,64.4 L3.1
N$42
  Top 0.254: D29.4 12.22,89.28 R5.1
N$46
  Bottom 0.406: R3.1 D13.C
N$47
  Bottom 0.406: D15.C R3.2
N$49
  Top 0.254: D29.2 12.95,91.95 R8.1
N$50
  Top 0.254: R8.2 17.58,91.06 U10.2
N$51
  Top 0.254: R5.2 17.46,90.06 U10.4
N$52
  Top 0.254: R4.2 16.81,90.56 U10.3
NOTHING
  cutout Top (isolate 0.305): 8.89,6.35 48.26,6.35 51.31,9.4 51.31,28.7 49.28,30.73 46.48,30.73 45.21,32 39.06,39.62 8.89,39.62
  cutout Route2 (isolate 0.305): 8.89,6.35 48.26,6.35 51.31,9.4 51.31,28.7 49.28,30.73 46.48,30.73 45.21,32 39,39.62 8.89,39.62
  cutout Route15 (isolate 0.305): 8.89,6.35 48.26,6.35 51.31,9.4 51.31,28.7 49.28,30.73 46.48,30.73 39.07,39.62 8.89,39.62
  cutout Bottom (isolate 0.305): 8.89,6.35 48.26,6.35 51.31,9.4 51.31,28.7 49.28,30.73 46.48,30.73 39.07,39.62 8.89,39.62
PARTICLE_RST
  Top 0.152: Q1.1 35.8,60.52 | R44.1 36.65,60.53 37.08,60.96 37.08,64.26 36.58,64.77 31.24,64.77 30.73,65.28 29.18,65.28 ASSY1.D3
  Top 0.203: 35.8,60.52 R44.1
REF_1V5  (via drill 0.2)
  Top 0.152: U2.4 6.35,30.93 6.35,27.18 C10.1 | U2.2 5.34,30.92 5.32,30.79 5.32,27.23 C13.1
  Top 0.203: U2.9 6.34,34.58 6.35,34.59 6.35,37.34 C12.1 6.17,38.35 6.86,39.04 7.04,39.04 v7.11,39.12 | U2.11 5.33,36.76 C11.1
  Top 0.305: U11.1 20.4,41.99 20.07,41.66 v16.76,41.66 | v6.35,25.65 6.35,26.85 C10.1 C13.1 | C12.1 C11.1
  Bottom 0.305: v16.76,41.66 9.65,41.66 v7.11,39.12 6.86,38.86 6.86,26.16 v6.35,25.65
REF_3V  (via drill 0.2)
  Top 0.152: C14.1 C19.1 3.48,48.04 4.14,48.75 5.35,48.75 U15.5 | U2.3 v5.84,29.97
  Top 0.305: U11.5 16.7,42.48 14.73,44.45 4.83,44.45 | 4.83,44.45 3.48,45.8 C14.1 | v3.81,43.43 4.83,44.45
  Bottom 0.305: v5.84,29.97 5.84,33.02 4.83,34.04 4.83,37.85 2.29,40.39 2.29,42.16 3.56,43.43 v3.81,43.43
SD_ENABLE  (via drill 0.2)
  Top 0.254: U13.3 28.18,77.52 R27.2 28.32,77.75 v28.32,78.49 | ASSY1.C2 9.83,68.63 10.41,69.22 v11.56,69.22
  Route15 0.254: v11.56,69.22 26.16,69.22 27.81,70.87 27.81,77.98 v28.32,78.49
SD_MISO  (via drill 0.2)
  Top 0.203: U1.6 11.05,72.52 19.43,80.9 26.42,80.9 ASSY1.A4 | J1.7 v32.51,72.04 31.52,72.04 R16.1
  Bottom 0.203: ASSY1.A4 30.15,84.38 32.26,82.27 32.26,72.39 32.51,72.14 v32.51,72.04
SD_MOSI  (via drill 0.2)
  Top 0.203: U1.9 11.13,74.12 18.8,81.79 24.77,81.79 26.42,83.44 26.42,85.34 26.87,85.8 31.52,85.8 ASSY1.A5 | J1.3 v32.89,76.44 31.44,76.44 R14.1
  Bottom 0.203: v32.89,76.44 32.89,84.31 32.69,84.52 ASSY1.A5
SD_SCLK  (via drill 0.2)
  Top 0.203: U1.7 10.79,73.03 19.18,81.41 19.3,81.41 25.65,81.41 27.61,83.36 ASSY1.A3
  Top 0.254: J1.5 31.55,74.24 v31.5,74.3
  Bottom 0.203: ASSY1.A3 27.61,84.12 31.5,80.24 v31.5,74.3
SENSORS_SCL  (via drill 0.2)
  Top 0.152: U10.12 22.26,92.62 v22.35,92.71 | ASSY1.D1 21.21,65.53 19.3,65.53 18.8,66.04 18.8,72.52 | U7.1 v18.8,74.17 18.8,72.52 | R17.1 18.8,72.52
  Top 0.203: U16.8 14.34,48.88 v15.24,49.78
  Route2 0.152: v21.34,85.85 22.35,86.87 v22.35,92.71
  Route2 0.203: v15.24,49.78 15.24,59.56 ASSY1.D1
  Bottom 0.152: v18.8,74.17 18.8,81.53 21.34,84.07 v21.34,85.85
SENSORS_SDA  (via drill 0.2)
  Top 0.152: ASSY1.D0 21.59,68.45 21.59,71.63 | 21.59,71.63 v21.59,74.68 20.83,74.68 U7.4 | v21.59,93.47 21.59,92.25 U10.13 | R13.1 21.59,71.63
  Top 0.203: U16.1 14.34,52.19 v14.48,52.32
  Route2 0.152: v21.59,74.68 21.59,81.53 23.88,83.82 23.88,87.12 23.11,87.88 23.11,93.22 22.86,93.47 v21.59,93.47
  Route2 0.203: v14.48,52.32 14.48,61.34 ASSY1.D0
SERIAL_NUM
  Top 0.203: U4.2 3.05,84.38 R12.2 4.7,84.58 ASSY1.B0
SWDCLK  (via drill 0.2)
  Top 0.152: U15.24 10.37,52.54 v10.41,52.58 | J2.4 27.43,90.17 24.13,90.17 22.86,88.9 v22.86,86.87
  Bottom 0.152: v10.41,52.58 9.91,53.09 7.11,53.09 6.1,54.1 6.1,55.37 5.59,55.88 1.78,55.88 1.27,56.39 1.27,85.09 2.79,86.61 22.61,86.61 v22.86,86.87
SWDIO  (via drill 0.2)
  Top 0.152: U15.23 10.39,50.29 10.92,50.29 v11.43,50.8 | v23.37,86.36 27.18,86.36 28.07,87.25 28.07,89.53 J2.2
  Bottom 0.152: v11.43,50.8 11.43,52.83 10.67,53.59 7.11,53.59 6.35,54.36 6.35,55.48 5.69,56.13 1.88,56.13 1.52,56.49 1.52,84.84 3.05,86.36 v23.37,86.36
VCC  (via drill 0.2, 0.3, 0.51)
  Top 0.152: 19.82,77.14 U7.9 | U7.9 U7.10 | 19.82,73.48 U7.2 U7.9 | Q2.2 42.66,90.1 R32.1 | 19.74,73.26 R17.2 19.74,71.78 | R13.2 19.89,70.43 | 12.7,92.96 11.25,91.52 10.41,90.68 10.41,86.87 9.4,85.85 3.25,85.85 R12.1 | U10.16 U10.15 U10.14 | U14.6 U14.5
  Top 0.203: R20.1 4.45,76.2 | U13.6 U13.5 | U10.16 20.04,92.2 19.56,92.2 19.43,92.08 | 19.43,92.08 19.39,92.04 U10.1 | D29.1 11.25,91.52 | 12.7,92.96 18.54,92.96 19.43,92.08 | U16.7 13.84,47.38 v13.97,47.24 | v4.45,74.3 3.86,74.3 C18.1 | C25.1 19.74,73.26 | 19.74,71.78 R13.2 | 19.89,70.43 v19.81,70.36
  Top 0.254: U1.13 4.45,74.28 v4.45,74.3 | 4.45,76.2 R19.1 5.16,76.63 v4.7,77.09 | C9.1 19.82,77.14 | 19.82,73.48 C25.1
  Top 0.305: R12.1 0.76,83.36 0.76,69.85 2.29,68.33 v3.05,68.33 | v44.7,89.41 43.36,89.41 R32.1
  Top 0.406: U14.6 19.62,49.72 v19.56,49.78
  Top 0.508: v25.91,70.36 25.93,70.36 | v39.12,60.2 40.72,60.2
  Top 0.61: 40.72,60.2 U12.6
  Top 0.635: U12.5 U12.6 | 25.93,70.36 U13.5
  Route15 0.203: v13.97,47.24 18.03,47.24 19.56,48.77 v19.56,49.78
  Route15 0.508: v19.56,49.78 21.08,49.78 22.1,50.8 22.1,59.18 23.62,60.71 38.61,60.71 v39.12,60.2
  Bottom 0.254: v4.7,77.09 4.45,76.83 v4.45,74.3 4.45,68.45
  Bottom 0.305: 45.21,70.36 45.21,81.53 44.2,82.55 44.2,88.9 v44.7,89.41
  Bottom 0.508: v3.05,68.33 3.05,68.45 4.45,68.45 17.78,68.45 19.68,70.36 v19.81,70.36 45.21,70.36 47.93,67.64 ASSY1.3V3 47.93,62.66 45.47,60.2 v39.12,60.2
  pour Route15 (isolate 0.152, rank 2): 55.75,0 0,0 0.13,95.25 55.63,95.25
VCC_RF
  Top 0.203: U8.14 49.4,49.4 48.57,48.57 46.74,48.57 | 46.74,48.57 C4.2 44.32,49.3 U3.6 | U3.2 46.48,49.78 46.74,49.53 46.74,48.57
WDI  (via drill 0.2)
  Top 0.203: R18.1 7.04,69.6 10.67,69.6 21.46,80.39 24.89,80.39 | 24.89,80.39 v26.8,80.39 | U9.6 25.2,63.44 23.88,64.77 23.88,68.07 24.64,68.83 24.64,80.14 24.89,80.39
  Top 0.254: R18.1 6.35,70.28 U1.2
  Route2 0.203: v26.8,80.39 30.73,80.39 34.98,84.63 ASSY1.DAC

## Text on the board
tNames: PowerWatch / Josh Adkins / Noah Klugman / Rev G, 5/19 | nLine, Inc.
Document: Antenna Entry / (from below) | Cell Antenna below / (No solid groundplane) | Wire Entry (above board)